# EAGLE design Medium_switch_HIGH_LOAD (EAGLE 9.6.2)
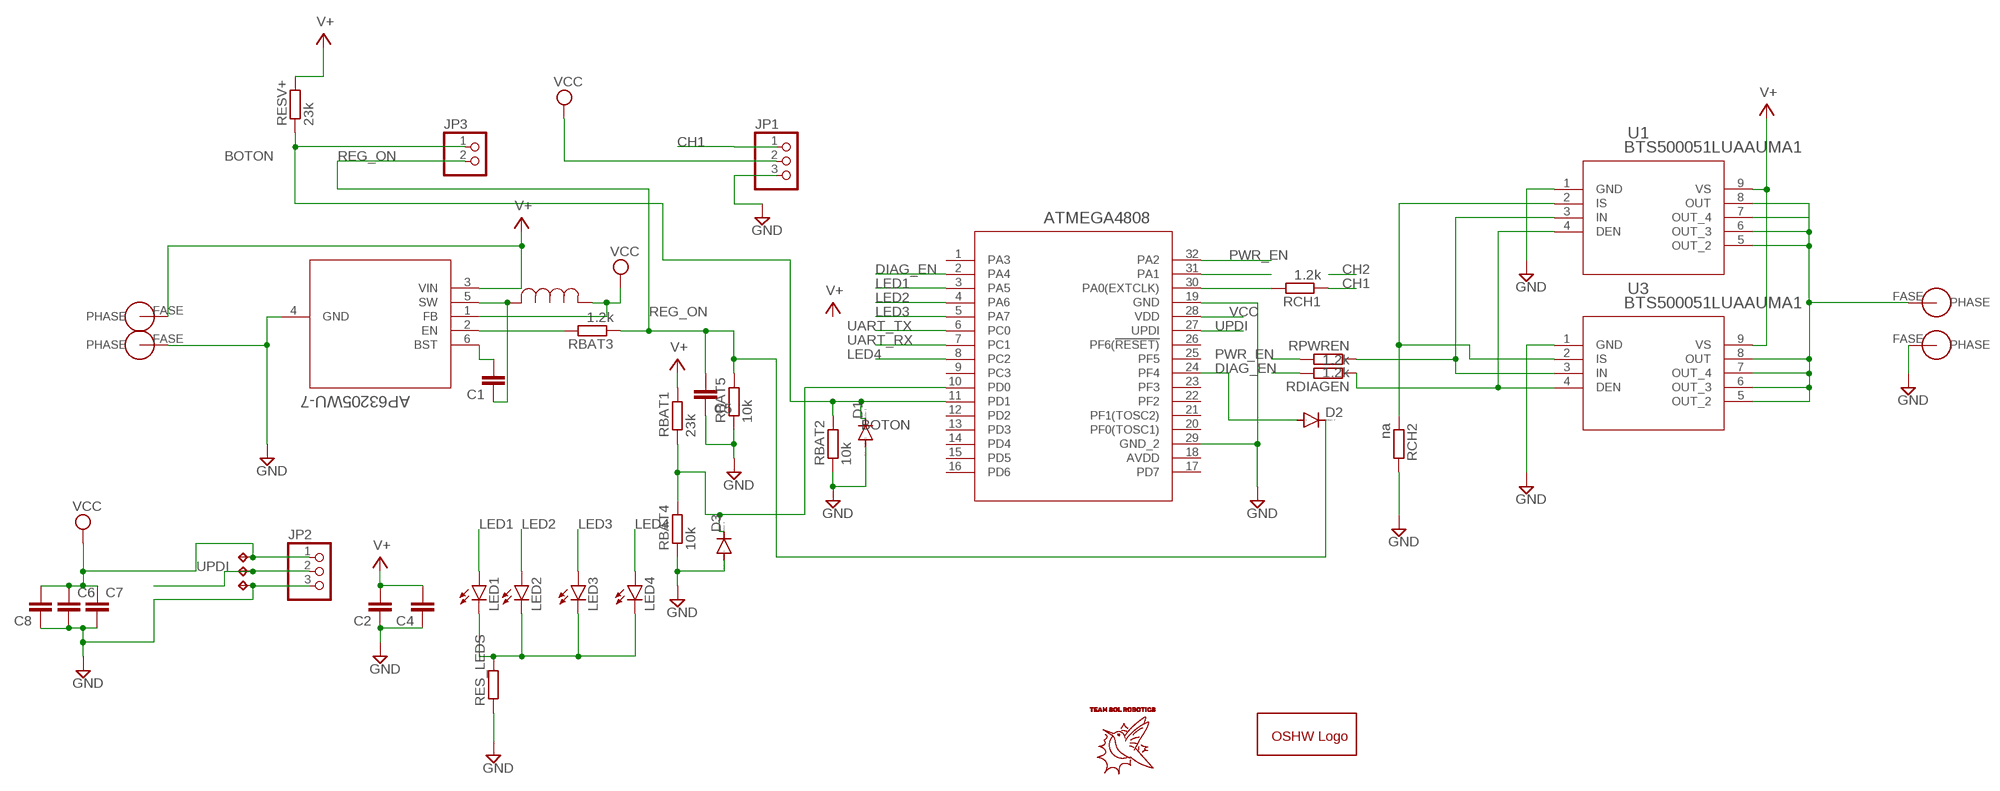
[diagram p0: schematic, sheet 1]

## Parts
BAT+  PHASE  [POWEROUT]
C1  C-EUC0402  [C0402]
C2  C-EUC1206  [C1206]
C4  C-EUC1206  [C1206]
C5  C-EUC0402  [C0402]
C6  C-EUC0805  [C0805]
C7  C-EUC0805  [C0805]
C8  C-EUC0402  [C0402]
D1  DIODE-MICROMELF-R  [MICROMELF-R]
D2  DIODE-MICROMELF-R  [MICROMELF-R]
D3  DIODE-MICROMELF-R  [MICROMELF-R]
FASEA1  PHASE  [POWEROUT]
FASEA3  PHASE  [POWEROUT]
GOLD_ORB_SM1  OSHWLOGOLOGO5MM  [OSHW_5MM]
JP1  PINHD-1X03_2.54-S  [1X03-S]
JP2  PINHD-1X03_2.54-S  [1X03-S]
JP3  PINHD-1X02_2.00  [1X02M]
LED1  LEDSML0603  [SML0603]
LED2  LEDSML0603  [SML0603]
LED3  LEDSML0603  [SML0603]
LED4  LEDSML0603  [SML0603]
OUTPUTPWR  PHASE  [POWEROUT]
RBAT1  23k  R-EU_R0603  [R0603]
RBAT2  10k  R-EU_R0603  [R0603]
RBAT3  1.2k  R-EU_R0603  [R0603]
RBAT4  10k  R-EU_R0603  [R0603]
RBAT5  10k  R-EU_R0603  [R0603]
RCH1  1.2k  R-EU_R0603  [R0603]
RCH2  na  R-EU_R0603  [R0603]
RDIAGEN  1.2k  R-EU_R0603  [R0603]
RES_LEDS  R-EU_R0603  [R0603]
RESV+  23k  R-EU_R0603  [R0603]
RPWREN  1.2k  R-EU_R0603  [R0603]
TP1  TPTP13SQ  [TP13SQ]
TP2  TPTP13SQ  [TP13SQ]
TP3  TPTP13SQ  [TP13SQ]
U1  BTS500051LUAAUMA1  [PG-HSOF-8_INF]
U2  AP63205WU-7  [SOIC_05WU-7_DIO]
U3  BTS500051LUAAUMA1  [PG-HSOF-8_INF]
U$1  ATMEGA4808  [QFP80P900X900X120-32N]
U$3  INDUCTOR4.7  [IND_NRS5030T100MMGJ_TAY]

## Nets
BOTON: D1.C JP3.1 RBAT2.2 RESV+.1 U$1.11(PD1)
CH1: JP1.1 RCH1.1
DIAG_EN: RDIAGEN.2 U$1.2(PA4)
GND: C2.1 C4.1 C5.1 C6.2 C7.2 C8.1 D1.A D3.A FASEA1.FASE(PHASE) FASEA3.FASE(PHASE) JP1.3 JP2.3 RBAT2.1 RBAT4.1 RBAT5.1 RCH2.2 RES_LEDS.1 TP2.TP U1.1(GND) U2.4(GND) U3.1(GND) U$1.19(GND) U$1.29(GND_2)
LED1: LED1.A U$1.3(PA5)
LED2: LED2.A U$1.4(PA6)
LED3: LED3.A U$1.5(PA7)
LED4: LED4.A U$1.8(PC2)
N$1: RBAT3.2 U2.2(EN)
N$2: LED1.C LED2.C LED3.C LED4.C RES_LEDS.2
N$3: RCH1.2 U$1.30(PA0(EXTCLK))
N$4: U$1.31(PA1)
N$5: D2.A U$1.24(PF4)
N$6: C1.1 U2.5(SW) U$3.2
N$7: RDIAGEN.1 U1.4(DEN) U3.4(DEN)
N$8: C1.2 U2.6(BST)
N$9: RPWREN.1 U1.3(IN) U3.3(IN)
N$10: OUTPUTPWR.FASE(PHASE) U1.5(OUT_2) U1.6(OUT_3) U1.7(OUT_4) U1.8(OUT) U3.5(OUT_2) U3.6(OUT_3) U3.7(OUT_4) U3.8(OUT)
N$11: D3.C RBAT1.1 RBAT4.2 U$1.10(PD0)
N$12: RCH2.1 U1.2(IS) U3.2(IS)
PWR_EN: RPWREN.2 U$1.32(PA2)
REG_ON: C5.2 D2.C JP3.2 RBAT3.1 RBAT5.2
UART_RX: U$1.7(PC1)
UART_TX: U$1.6(PC0)
UPDI: JP2.2 TP3.TP U$1.27(UPDI)
V+: BAT+.FASE(PHASE) C2.2 C4.2 RBAT1.2 RESV+.2 U1.9(VS) U2.3(VIN) U3.9(VS)
VCC: C6.1 C7.1 C8.2 JP1.2 JP2.1 TP1.TP U2.1(FB) U$1.28(VDD) U$3.1
Unconnected: U$1.1(PA3) U$1.9(PC3) U$1.12(PD2) U$1.13(PD3) U$1.14(PD4) U$1.15(PD5) U$1.16(PD6) U$1.17(PD7) U$1.20(PF0(TOSC1)) U$1.21(PF1(TOSC2)) U$1.22(PF2) U$1.23(PF3) U$1.25(PF5) U$1.26(PF6(!RESET))

## Power pins joined to a net without a drawn wire
AVDD: U$1.18(AVDD)

## Library data of the parts
BAT+ FASEA1 FASEA3 OUTPUTPWR = PHASE:PHASE
C1 C2 C4-C8 = rcl:C-EU: CAPACITOR, European symbol; SPICEPREFIX: C
D1-D3 = diode:DIODE-: DIODE
GOLD_ORB_SM1 = oshw:OSHWLOGO: The OSHW logo for PCB layout
JP1 JP2 = pinhead-2:PINHD-1X03: PIN HEADER
JP3 = pinhead-2:PINHD-1X02: PIN HEADER
LED1-LED4 = led:LED: LED OSRAM: - CHIPLED LG R971, LG N971, LY N971, LG Q971, LY Q971, LO R971, LY R971 LH N974, LH R974 LS Q976, LO Q976, LY Q976 LO Q996 - Hyper CHIPLED LW Q18S LB Q993, LB Q99A, LB R99A - SideLED LS A670, LO A670, LY A670, LG A670, LP A670 LB A673, LV A673, LT A673, LW A673 LH A674 LY A675 LS A676, LA A676, LO A676, LY A676, LW A676 LS A679, LY A679, LG A679 - Hyper Micro SIDELED® LS Y876, LA Y876, LO Y876, LY Y876 LT Y87S - SmartLED LW L88C, LW L88S LB L89C, LB L89S, LG L890 LS L89K, LO L89K, LY L89K LS L896, LA L896, LO L896, LY L896 - TOPLED LS T670, LO T670, LY T670, LG T670, LP T670 LSG T670, LSP T670, LSY T670, LOP T670, LYG T670 LG T671, LOG T671, LSG T671 LB T673, LV T673, LT T673, LW T673 LH T674 LS T676, LA T676, LO T676, LY T676, LB T676, LH T676, LSB T676, LW T676 LB T67C, LV T67C, LT T67C, LS T67K, LO T67K, LY T67K, LW E67C LS E67B, LA E67B, LO E67B, LY E67B, LB E67C, LV E67C, LT E67C LW T67C LS T679, LY T679, LG T679 LS T770, LO T770, LY T770, LG T770, LP T770 LB T773, LV T773, LT T773, LW T773 LH T774 LS E675, LA E675, LY E675, LS T675 LS T776, LA T776, LO T776, LY T776, LB T776 LHGB T686 LT T68C, LB T68C - Hyper Mini TOPLED® LB M676 - Mini TOPLED Santana® LG M470 LS M47K, LO M47K, LY M47K Source: http://www.osram.convergy.de LUXEON: - LUMILED® LXK2-PW12-R00, LXK2-PW12-S00, LXK2-PW14-U00, LXK2-PW14-V00 LXK2-PM12-R00, LXK2-PM12-S00, LXK2-PM14-U00 LXK2-PE12-Q00, LXK2-PE12-R00, LXK2-PE12-S00, LXK2-PE14-T00, LXK2-PE14-U00 LXK2-PB12-K00, LXK2-PB12-L00, LXK2-PB12-M00, LXK2-PB14-N00, LXK2-PB14-P00, LXK2-PB14-Q00 LXK2-PR12-L00, LXK2-PR12-M00, LXK2-PR14-Q00, LXK2-PR14-R00 LXK2-PD12-Q00, LXK2-PD12-R00, LXK2-PD12-S00 LXK2-PH12-R00, LXK2-PH12-S00 LXK2-PL12-P00, LXK2-PL12-Q00, LXK2-PL12-R00 Source: www.luxeon.com KINGBRIGHT: KA-3528ASYC Source: www.kingbright.com
RBAT1-RBAT5 RCH1 RCH2 RDIAGEN RES_LEDS RESV+ RPWREN = rcl:R-EU_: RESISTOR, European symbol; SPICEPREFIX: R
TP1-TP3 = testpad:TP: Test pad
U1 U3 = HSS_HIGH_load_bts500051:BTS500051LUAAUMA1; COPYRIGHT: Copyright (C) 2024 Ultra Librarian. All rights reserved.; MANUFACTURER_PART_NUMBER: BTS500051LUAAUMA1; MFR_NAME: Infineon; TYPE: Power Management
U2 = AP63205WU-7:AP63205WU-7; BUILT_BY: EMA_Matt; COPYRIGHT: Copyright (C) 2018 Accelerated Designs. All rights reserved; MANUFACTURER_PART_NUMBER: AP63205WU-7; SOURCELIBRARY: Diodes_Inc_2019-12-05; VENDOR: Diodes Inc
U$1 = Atmega4808:ATMEGA4808
U$3 = Inductor4.7:INDUCTOR4.7

## Board
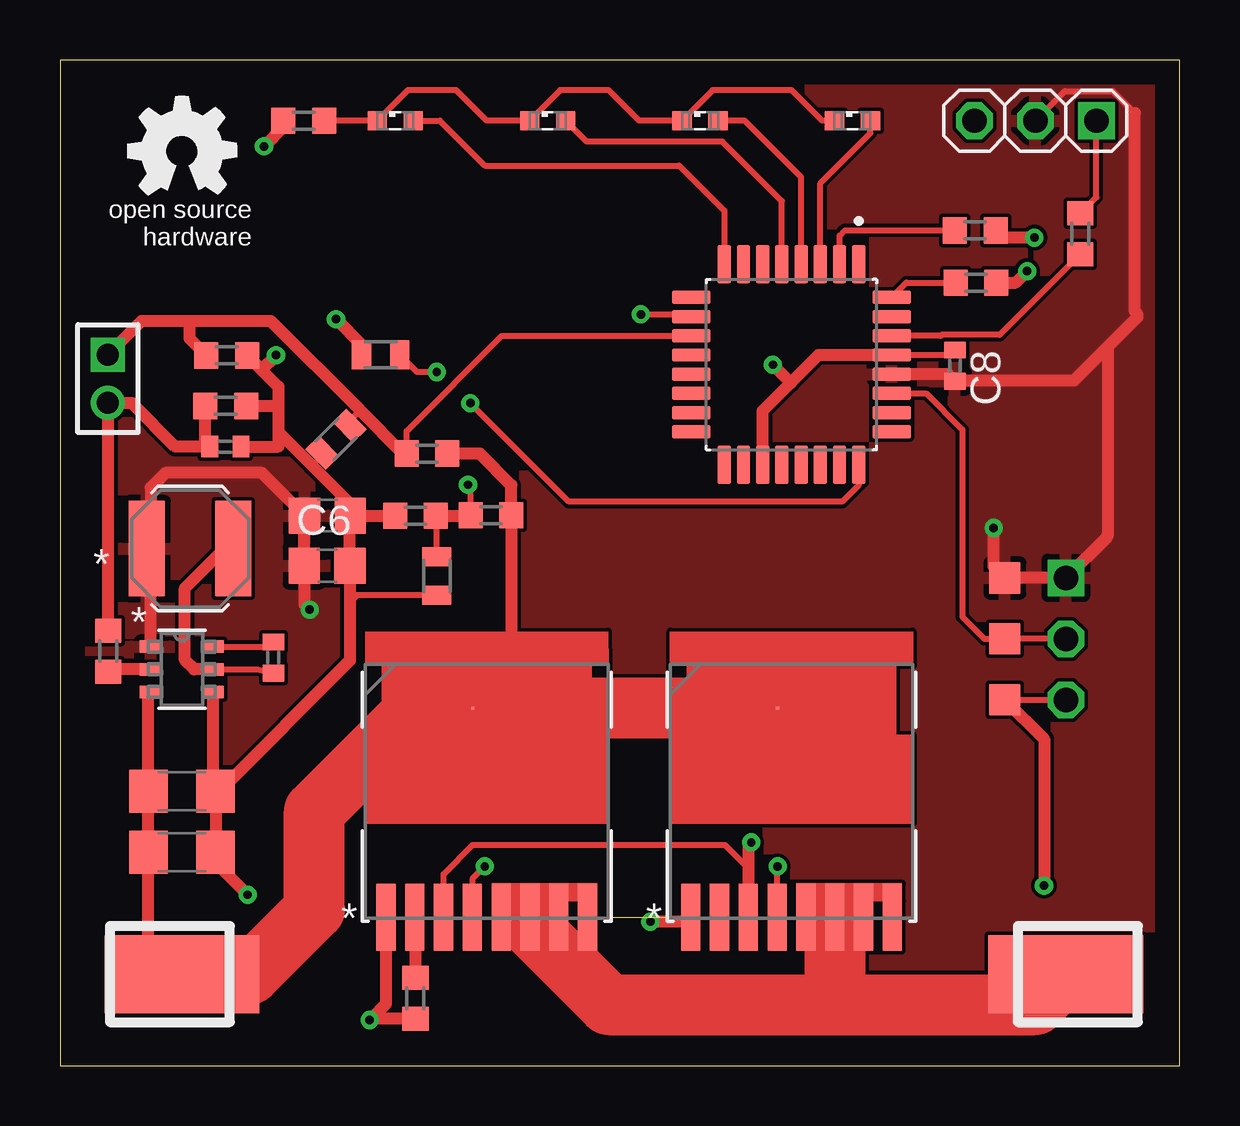
[diagram p1: board, top side]
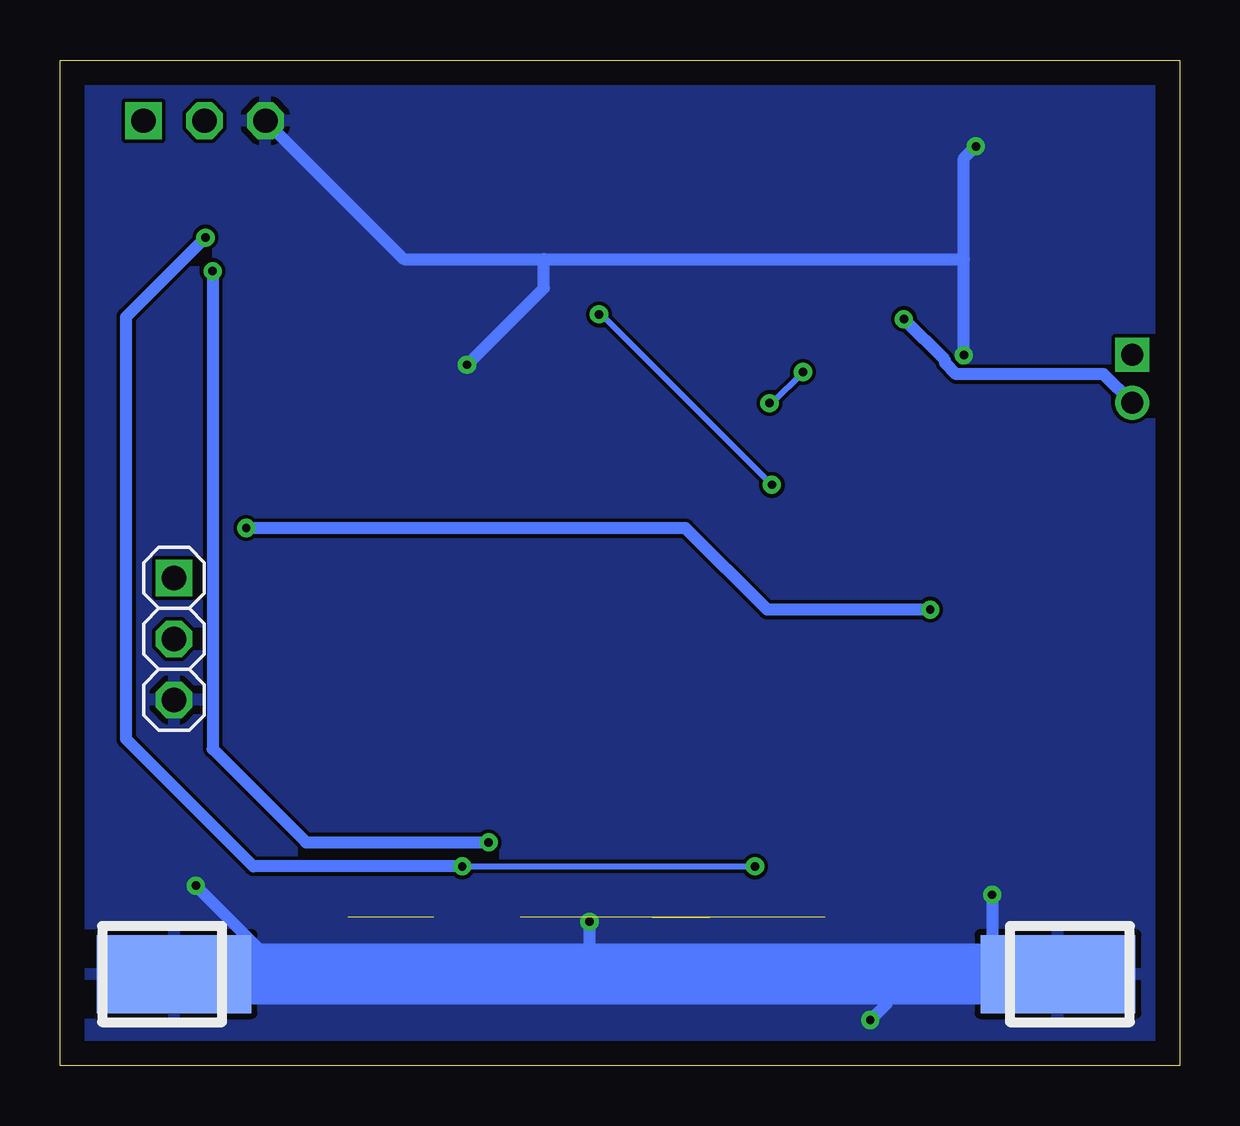
[diagram p2: board, bottom side, seen from below]

Size 46.66 x 41.9 mm. Coordinates in mm from the lower left corner, seen from the top.
Outline: 0,0 46.66,0 46.66,41.9 0,41.9 0,0
Copper layers (1*16): Top 0.035mm / dielectric 1.5mm / Bottom 0.035mm
Design rules "default": minimum track width 6mil, minimum drill 0.35mm, track to track 6mil, track to pad 6mil, pad to pad 6mil, via to via 6mil, smd to smd 6mil, copper to edge 40mil, drill to drill 6mil, minimum pad ring 10mil, minimum via ring 8mil, stop-mask expansion 4mil, vias tented up to drill 0mil, thermal gap 10mil

### Footprints (pad centres in the part's own frame; a part is rotated, then mirrored left to right if it is on the bottom)
POWEROUT = smd 3.251 x 6.452: FASE 0,0
C0402 = smd 0.7 x 0.9: 1 -0.65,0; 2 0.65,0
C1206 = smd 1.6 x 1.8: 1 -1.4,0; 2 1.4,0
C0805 = smd 1.3 x 1.5: 1 -0.95,0; 2 0.95,0
MICROMELF-R = smd 0.8 x 1.2: A 0.8,0; C -0.8,0
1X03-S = drill 1.016 square: 1 -2.54,0 | drill 1.016 octagon: 2 0,0; 3 2.54,0
1X02M = drill 0.914 square: 1 -1,0 | drill 0.914: 2 1,0
SML0603 = smd 0.8 x 0.8: A 0.75,0; C -0.75,0
R0603 = smd 1 x 1.1: 1 -0.85,0; 2 0.85,0
TP13SQ = smd 1.3 x 1.3: TP 0,0
PG-HSOF-8_INF = smd 0.8 x 2.8: 1 -4.2,-5.25; 2 -3,-5.25; 3 -1.8,-5.25; 4 -0.6,-5.25; 5 0.6,-5.25; 6 1.8,-5.25; 7 3,-5.25; 8 4.2,-5.25 | smd 0.127 x 0.127: 9 -0.584,3.454
SOIC_05WU-7_DIO = smd 0.896 x 0.517: 1 -1.299,0.95; 2 -1.299,0; 3 -1.299,-0.95; 4 1.299,-0.95; 5 1.299,0; 6 1.299,0.95
QFP80P900X900X120-32N = smd 1.6 x 0.55: 1 -4.18,2.8; 2 -4.18,2; 3 -4.18,1.2; 4 -4.18,0.4; 5 -4.18,-0.4; 6 -4.18,-1.2; 7 -4.18,-2; 8 -4.18,-2.8; 17 4.18,-2.8; 18 4.18,-2; 19 4.18,-1.2; 20 4.18,-0.4; 21 4.18,0.4; 22 4.18,1.2; 23 4.18,2; 24 4.18,2.8 | smd 0.55 x 1.6: 9 -2.8,-4.18; 10 -2,-4.18; 11 -1.2,-4.18; 12 -0.4,-4.18; 13 0.4,-4.18; 14 1.2,-4.18; 15 2,-4.18; 16 2.8,-4.18; 25 2.8,4.18; 26 2,4.18; 27 1.2,4.18; 28 0.4,4.18; 29 -0.4,4.18; 30 -1.2,4.18; 31 -2,4.18; 32 -2.8,4.18
IND_NRS5030T100MMGJ_TAY = smd 1.499 x 3.988: 1 -1.8,0; 2 1.8,0

### Placement (x,y rotation side)
BAT+  5.08,3.81 270 top
C1  8.89,17 90 top
C2  5.08,8.89 180 top
C4  5.08,11.43 180 top
C5  6.89,25.79 180 top
C6  11.13,20.83 0 top
C7  11.14,22.92 0 top
C8  37.29,29.17 270 top
D1  11.5,26.1 225 top
D2  13.36,29.62 0 top
D3  15.7,20.4 270 top
FASEA1  41.91,3.81 270 bottom
FASEA3  5.08,3.81 90 bottom
GOLD_ORB_SM1  5.08,38.1 0 top
JP1  40.64,39.37 180 top
JP2  41.91,17.78 270 bottom
JP3  1.99,28.62 270 top
LED1  33.02,39.37 0 top
LED2  26.67,39.37 0 top
LED3  20.32,39.37 0 top
LED4  13.97,39.37 0 top
OUTPUTPWR  41.91,3.81 90 top
RBAT1  17.96,22.93 0 top
RBAT2  6.95,29.59 180 top
RBAT3  2.01,17.27 270 top
RBAT4  14.81,22.91 0 top
RBAT5  6.91,27.49 180 top
RCH1  42.51,34.66 270 top
RCH2  14.81,2.81 270 top
RDIAGEN  38.13,34.8 180 top
RES_LEDS  10.16,39.37 0 top
RESV+  15.29,25.5 0 top
RPWREN  38.17,32.62 180 top
TP1  39.37,20.32 0 top
TP2  39.37,15.24 0 top
TP3  39.37,17.78 0 top
U1  17.78,11.43 0 top
U2  5.08,16.51 0 top
U3  30.48,11.43 0 top
U$1  30.48,29.21 270 top
U$3  5.42,21.54 0 top

### Tracks (layer width: path | path; a pad name or v marks a point on that pad's centre or on a via)
BOTON
  Top 0.254: RESV+.1 14.44,26.44 18.41,30.41 U$1.11 | D1.C 12.07,26.87 12.5,27.3
  Top 0.508: RESV+.1 14.3,25.5 12.5,27.3 8.78,31.02 5.4,31.02 | 5.4,31.02 3.39,31.02 JP3.1 | RBAT2.2 5.4,30.29 5.4,31.02
CH1
  Top 0.254: RCH1.1 43.18,36.18 JP1.1
DIAG_EN
  Top 0.254: U$1.2 32.48,34.58 32.7,34.8 RDIAGEN.2
GND  (via drill 0.35)
  Top 0.254: U$1.29 34.8,29.61 37.08,29.61 C8.1 | TP2.TP JP2.3 | D3.A 12.38,19.6 12.08,19.3 | D1.A 10.93,25.43 10.5,25
  Top 0.508: v7.82,7.12 6.48,8.46 C2.1 C4.1 | C4.1 6.38,11.53 U2.4 | C4.1 6.63,11.43 12.08,16.88 12.08,19.3 C6.2 12.08,23.19 12.09,23.2 | C5.1 9.1,25.79 9.1,26.29 | 9.1,26.29 9.21,26.29 10.5,25 12.09,23.41 12.09,23.2 | 12.09,23.2 C7.2 RBAT4.1 | RCH2.2 12.96,1.96 | 12.96,1.96 v12.9,1.9 | U3.1 26.1,6 v24.6,6 | RBAT2.1 8.39,29 | 8.39,29 9.1,28.29 9.1,27.5 | 9.1,27.5 9.1,26.29 | RBAT5.1 9.1,27.5 | RES_LEDS.1 9.31,39.11 v8.5,38.3 | 8.39,29 v9,29.6 | U1.1 13.58,2.58 12.96,1.96 | U$1.19 29.28,27.28 30.45,28.45 | 34.8,29.61 31.61,29.61 30.45,28.45 | 30.45,28.45 v29.7,29.2 | TP2.TP 41,13.61 v41,7.5
  Bottom 0.508: v7.82,7.12 7.82,3.81 | v12.9,1.9 12.2,2.6 12.2,3.81 | v24.6,6 24.6,4.11 24.3,3.81 | v9,29.6 9,33.6 | 9,33.6 9,37.8 v8.5,38.3 | v29.7,29.2 26.5,32.4 26.5,33.6 | JP1.3 32.33,33.6 26.5,33.6 | 26.5,33.6 9,33.6 | v41,7.5 37.4,3.9 37.4,3.81
  Bottom 2.54: FASEA3.FASE 7.82,3.81 12.2,3.81 24.3,3.81 37.4,3.81 FASEA1.FASE
  pour Bottom: 0.1,0.1 0.1,41.9 46.6,41.9 46.6,0.1
LED1
  Top 0.254: U$1.3 31.68,36.76 33.77,38.85 LED1.A
LED2
  Top 0.254: U$1.4 30.88,37.02 28.53,39.37 LED2.A
LED3
  Top 0.254: U$1.5 30.08,36.02 27.6,38.5 21.94,38.5 LED3.A
LED4
  Top 0.254: LED4.A 15.83,39.37 17.7,37.5 25.8,37.5 27.68,35.62 U$1.8
N$1
  Top 0.508: U2.2 2.1,16.51 RBAT3.2
N$2
  Top 0.254: RES_LEDS.2 LED4.C 14.49,40.64 16.51,40.64 17.78,39.37 LED3.C 20.84,40.64 22.86,40.64 24.13,39.37 LED2.C 27.19,40.64 30.48,40.64 31.75,39.37 LED1.C
N$3
  Top 0.254: U$1.30 36.69,30.41 36.72,30.45 39.15,30.45 RCH1.2
N$5  (via drill 0.35)
  Top 0.254: U$1.24 33.28,24.18 32.6,23.5 21.2,23.5 v17.1,27.6 | v15.7,28.9 14.88,28.9 D2.A
  Bottom 0.254: v17.1,27.6 17,27.6 v15.7,28.9
N$6
  Top 0.254: C1.1 8.24,16.51 U2.5
  Top 0.508: U2.5 5.59,16.51 5.2,16.9 5.2,19.9 6.84,21.54 U$3.2
N$7  (via drill 0.35)
  Top 0.254: U3.4 29.88,8.28 v29.9,8.3 | v17.7,8.3 17.18,7.78 U1.4
  Top 0.508: v40.6,34.5 39.28,34.5 RDIAGEN.1
  Bottom 0.254: v29.9,8.3 v17.7,8.3
  Bottom 0.508: v29.9,8.3 38.6,8.3 43.9,13.6 43.9,31.2 v40.6,34.5
N$8
  Top 0.254: U2.6 8.59,17.46 C1.2
N$9  (via drill 0.35)
  Top 0.254: U1.3 15.98,7.98 17.2,9.2 27.7,9.2 28.68,8.22 28.68,6.8 U3.3
  Top 0.508: RPWREN.1 39.82,32.62 v40.3,33.1 | v28.8,9.3 28.68,9.18 28.68,6.8
  Bottom 0.508: v40.3,33.1 40.3,13.2 36.4,9.3 v28.8,9.3
N$10  (6 unrouted)
  Top 2.54: U1.6 19.58,5.82 22.86,2.54 33.02,2.54 | OUTPUTPWR.FASE 40.64,2.54 33.02,2.54 | U3.6 32.28,3.28 33.02,2.54
N$11  (via drill 0.35)
  Top 0.254: RBAT1.1 17.11,24.09 v17,24.2 | v24.2,31.3 26.21,31.3 U$1.10 | D3.C 15.7,22.87 RBAT4.2
  Top 0.508: RBAT4.2 17.09,22.91 RBAT1.1
  Bottom 0.254: v17,24.2 24.1,31.3 v24.2,31.3
N$12  (1 unrouted)
  Top 0.508: U1.2 14.81,6.15 RCH2.1
PWR_EN
  Top 0.254: U$1.32 35.27,32.62 RPWREN.2
REG_ON  (via drill 0.35)
  Top 0.508: RBAT3.1 2.01,27.6 | 2.01,27.6 JP3.2 | 2.01,27.6 3,27.6 4.81,25.79 C5.2 6.06,25.97 RBAT5.2 | v11.5,31.1 12.56,30.04 D2.C
  Bottom 0.508: JP3.2 3.19,28.82 9.32,28.82 9.79,29.27 9.79,29.39 v11.5,31.1
UPDI
  Top 0.254: JP2.2 TP3.TP 38.52,17.78 37.6,18.7 37.6,26.5 36.09,28.01 U$1.27
V+
  Top 0.508: BAT+.FASE 3.68,5.21 C2.2 C4.2 3.68,15.46 U2.3 | U1.9 18.81,16.5 RBAT1.2 18.81,24.19 17.5,25.5 RESV+.2
  Top 2.54: U3.9 U1.9 14.88,14.88 10.6,10.6 10.6,6.5 7.91,3.81 BAT+.FASE
VCC  (via drill 0.35)
  Top 0.254: JP1.2 41.87,40.6 43.87,40.6 44.78,39.69 | 44.9,31.2 44.9,31.3 | 43.6,29.9 43.65,29.95 43.65,22.1 43.65,22.06
  Top 0.508: U2.1 3.78,21.38 | 3.78,21.38 U$3.1 | 3.78,21.38 3.78,24.08 4.4,24.7 8.41,24.7 C7.1 C6.1 10.18,19.22 v10.4,19 | 43.65,22.06 JP2.1 TP1.TP 38.9,20.79 v38.9,22.4 | 43.65,22.1 43.65,29.85 43.6,29.9 42.25,28.55 37.32,28.55 C8.2 37,28.81 U$1.28 | 43.65,29.95 44.9,31.2 | 44.9,31.3 44.78,31.41 44.78,39.69
  Bottom 0.508: v10.4,19 17.2,19 20.6,22.4 v38.9,22.4
  pour Top: -0.1,0.1 -0.1,41.9 46.6,41.9 46.6,0.1